# EAGLE schematic untitled (EAGLE 9.6.2)
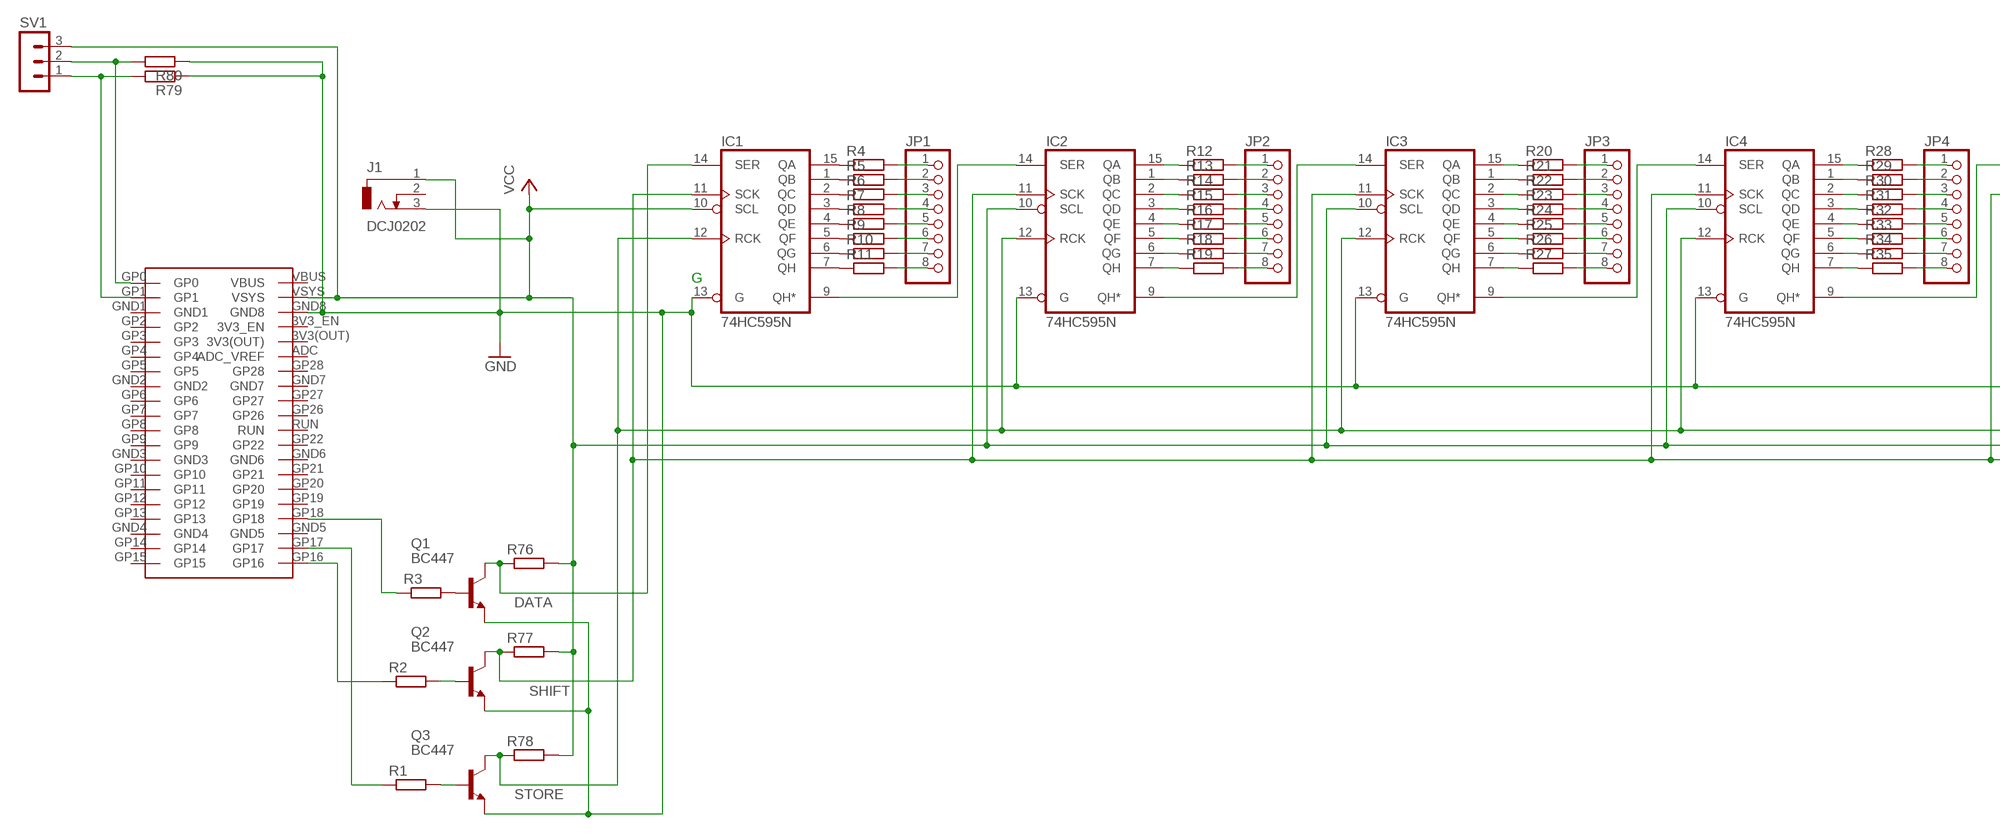
[diagram p0: schematic, sheet 1, part 1 of 2]
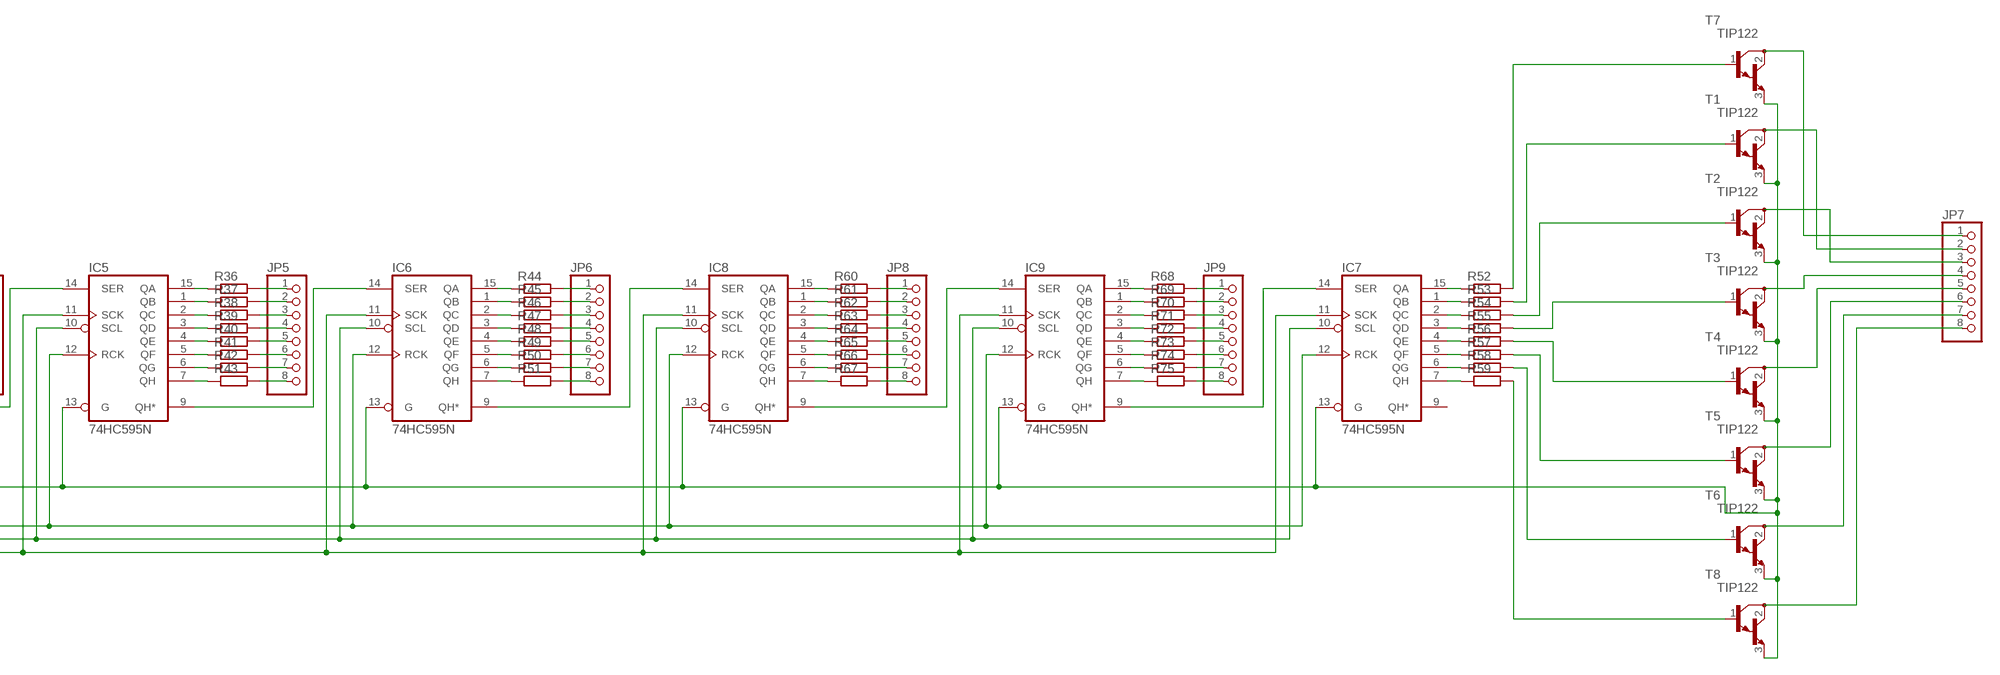
[diagram p1: schematic, sheet 1, part 2 of 2]

## Parts
IC1  74HC595N  [DIL16]
IC2  74HC595N  [DIL16]
IC3  74HC595N  [DIL16]
IC4  74HC595N  [DIL16]
IC5  74HC595N  [DIL16]
IC6  74HC595N  [DIL16]
IC7  74HC595N  [DIL16]
IC8  74HC595N  [DIL16]
IC9  74HC595N  [DIL16]
J1  DCJ0202  [DCJ0202]
JP1  PINHD-1X8  [1X08]
JP2  PINHD-1X8  [1X08]
JP3  PINHD-1X8  [1X08]
JP4  PINHD-1X8  [1X08]
JP5  PINHD-1X8  [1X08]
JP6  PINHD-1X8  [1X08]
JP7  PINHD-1X8  [1X08]
JP8  PINHD-1X8  [1X08]
JP9  PINHD-1X8  [1X08]
Q1  BC447  [TO92-EBC]
Q2  BC447  [TO92-EBC]
Q3  BC447  [TO92-EBC]
R1  R-EU_0207/10  [0207/10]
R2  R-EU_0207/10  [0207/10]
R3  R-EU_0207/10  [0207/10]
R4  R-EU_0207/10  [0207/10]
R5  R-EU_0207/10  [0207/10]
R6  R-EU_0207/10  [0207/10]
R7  R-EU_0207/10  [0207/10]
R8  R-EU_0207/10  [0207/10]
R9  R-EU_0207/10  [0207/10]
R10  R-EU_0207/10  [0207/10]
R11  R-EU_0207/10  [0207/10]
R12  R-EU_0207/10  [0207/10]
R13  R-EU_0207/10  [0207/10]
R14  R-EU_0207/10  [0207/10]
R15  R-EU_0207/10  [0207/10]
R16  R-EU_0207/10  [0207/10]
R17  R-EU_0207/10  [0207/10]
R18  R-EU_0207/10  [0207/10]
R19  R-EU_0207/10  [0207/10]
R20  R-EU_0207/10  [0207/10]
R21  R-EU_0207/10  [0207/10]
R22  R-EU_0207/10  [0207/10]
R23  R-EU_0207/10  [0207/10]
R24  R-EU_0207/10  [0207/10]
R25  R-EU_0207/10  [0207/10]
R26  R-EU_0207/10  [0207/10]
R27  R-EU_0207/10  [0207/10]
R28  R-EU_0207/10  [0207/10]
R29  R-EU_0207/10  [0207/10]
R30  R-EU_0207/10  [0207/10]
R31  R-EU_0207/10  [0207/10]
R32  R-EU_0207/10  [0207/10]
R33  R-EU_0207/10  [0207/10]
R34  R-EU_0207/10  [0207/10]
R35  R-EU_0207/10  [0207/10]
R36  R-EU_0207/10  [0207/10]
R37  R-EU_0207/10  [0207/10]
R38  R-EU_0207/10  [0207/10]
R39  R-EU_0207/10  [0207/10]
R40  R-EU_0207/10  [0207/10]
R41  R-EU_0207/10  [0207/10]
R42  R-EU_0207/10  [0207/10]
R43  R-EU_0207/10  [0207/10]
R44  R-EU_0207/10  [0207/10]
R45  R-EU_0207/10  [0207/10]
R46  R-EU_0207/10  [0207/10]
R47  R-EU_0207/10  [0207/10]
R48  R-EU_0207/10  [0207/10]
R49  R-EU_0207/10  [0207/10]
R50  R-EU_0207/10  [0207/10]
R51  R-EU_0207/10  [0207/10]
R52  R-EU_0207/10  [0207/10]
R53  R-EU_0207/10  [0207/10]
R54  R-EU_0207/10  [0207/10]
R55  R-EU_0207/10  [0207/10]
R56  R-EU_0207/10  [0207/10]
R57  R-EU_0207/10  [0207/10]
R58  R-EU_0207/10  [0207/10]
R59  R-EU_0207/10  [0207/10]
R60  R-EU_0207/10  [0207/10]
R61  R-EU_0207/10  [0207/10]
R62  R-EU_0207/10  [0207/10]
R63  R-EU_0207/10  [0207/10]
R64  R-EU_0207/10  [0207/10]
R65  R-EU_0207/10  [0207/10]
R66  R-EU_0207/10  [0207/10]
R67  R-EU_0207/10  [0207/10]
R68  R-EU_0207/10  [0207/10]
R69  R-EU_0207/10  [0207/10]
R70  R-EU_0207/10  [0207/10]
R71  R-EU_0207/10  [0207/10]
R72  R-EU_0207/10  [0207/10]
R73  R-EU_0207/10  [0207/10]
R74  R-EU_0207/10  [0207/10]
R75  R-EU_0207/10  [0207/10]
R76  R-EU_0207/10  [0207/10]
R77  R-EU_0207/10  [0207/10]
R78  R-EU_0207/10  [0207/10]
R79  R-EU_0207/10  [0207/10]
R80  R-EU_0207/10  [0207/10]
SV1  MA03-1  [MA03-1]
T1  TIP122  [TO220]
T2  TIP122  [TO220]
T3  TIP122  [TO220]
T4  TIP122  [TO220]
T5  TIP122  [TO220]
T6  TIP122  [TO220]
T7  TIP122  [TO220]
T8  TIP122  [TO220]
U$2  PI_PICO  [PI_PICO]

## Nets
DATA: IC1.14(SER) Q1.C R76.1
GND: IC1.13(G) IC2.13(G) IC3.13(G) IC4.13(G) IC5.13(G) IC6.13(G) IC7.13(G) IC8.13(G) IC9.13(G) J1.3 Q1.E Q2.E Q3.E R79.1 R80.1 T1.3(E) T2.3(E) T3.3(E) T4.3(E) T5.3(E) T6.3(E) T7.3(E) T8.3(E) U$2.GND8
N$1: R1.1 U$2.GP17
N$2: Q3.B R1.2
N$4: Q2.B R2.2
N$5: Q1.B R3.2
N$6: R3.1 U$2.GP18
N$7: R2.1 U$2.GP16
N$8: IC1.15(QA) R4.1
N$9: IC1.5(QF) R9.1
N$10: IC1.6(QG) R10.1
N$11: IC1.7(QH) R11.1
N$12: JP1.1 R4.2
N$13: JP1.2 R5.2
N$14: IC1.1(QB) R5.1
N$15: IC1.2(QC) R6.1
N$16: IC1.3(QD) R7.1
N$17: IC1.4(QE) R8.1
N$18: JP1.3 R6.2
N$19: JP1.4 R7.2
N$20: JP1.5 R8.2
N$21: JP1.6 R9.2
N$22: JP1.7 R10.2
N$23: JP1.8 R11.2
N$24: IC2.1(QB) R13.1
N$25: IC2.2(QC) R14.1
N$26: IC2.3(QD) R15.1
N$27: IC2.4(QE) R16.1
N$28: IC1.9(QH*) IC2.14(SER)
N$29: IC2.15(QA) R12.1
N$30: IC2.5(QF) R17.1
N$31: IC2.6(QG) R18.1
N$32: IC2.7(QH) R19.1
N$33: JP2.1 R12.2
N$34: JP2.2 R13.2
N$35: JP2.3 R14.2
N$36: JP2.4 R15.2
N$37: JP2.5 R16.2
N$38: JP2.6 R17.2
N$39: JP2.7 R18.2
N$40: JP2.8 R19.2
N$41: R80.2 SV1.2 U$2.GP0
N$42: IC2.9(QH*) IC3.14(SER)
N$43: R79.2 SV1.1 U$2.GP1
N$44: IC3.1(QB) R21.1
N$45: IC3.2(QC) R22.1
N$46: IC3.3(QD) R23.1
N$47: IC3.4(QE) R24.1
N$48: IC3.15(QA) R20.1
N$49: IC3.5(QF) R25.1
N$50: IC3.6(QG) R26.1
N$51: IC3.7(QH) R27.1
N$52: JP3.1 R20.2
N$53: JP3.2 R21.2
N$54: JP3.3 R22.2
N$55: JP3.4 R23.2
N$56: JP3.5 R24.2
N$57: JP3.6 R25.2
N$58: JP3.7 R26.2
N$59: JP3.8 R27.2
N$60: IC7.15(QA) R52.1
N$61: IC3.9(QH*) IC4.14(SER)
N$62: IC7.1(QB) R53.1
N$63: IC4.1(QB) R29.1
N$64: IC4.2(QC) R30.1
N$65: IC4.3(QD) R31.1
N$66: IC4.4(QE) R32.1
N$67: IC4.15(QA) R28.1
N$68: IC4.5(QF) R33.1
N$69: IC4.6(QG) R34.1
N$70: IC4.7(QH) R35.1
N$71: JP4.1 R28.2
N$72: JP4.2 R29.2
N$73: JP4.3 R30.2
N$74: JP4.4 R31.2
N$75: JP4.5 R32.2
N$76: JP4.6 R33.2
N$77: JP4.7 R34.2
N$78: JP4.8 R35.2
N$79: IC7.2(QC) R54.1
N$80: IC4.9(QH*) IC5.14(SER)
N$81: IC7.3(QD) R55.1
N$82: IC5.1(QB) R37.1
N$83: IC5.2(QC) R38.1
N$84: IC5.3(QD) R39.1
N$85: IC5.4(QE) R40.1
N$86: IC5.15(QA) R36.1
N$87: IC5.5(QF) R41.1
N$88: IC5.6(QG) R42.1
N$89: IC5.7(QH) R43.1
N$90: JP5.1 R36.2
N$91: JP5.2 R37.2
N$92: JP5.3 R38.2
N$93: JP5.4 R39.2
N$94: JP5.5 R40.2
N$95: JP5.6 R41.2
N$96: JP5.7 R42.2
N$97: JP5.8 R43.2
N$98: IC7.4(QE) R56.1
N$99: IC5.9(QH*) IC6.14(SER)
N$100: IC7.5(QF) R57.1
N$101: IC6.1(QB) R45.1
N$102: IC6.2(QC) R46.1
N$103: IC6.3(QD) R47.1
N$104: IC6.4(QE) R48.1
N$105: IC6.15(QA) R44.1
N$106: IC6.5(QF) R49.1
N$107: IC6.6(QG) R50.1
N$108: IC6.7(QH) R51.1
N$109: JP6.1 R44.2
N$110: JP6.2 R45.2
N$111: JP6.3 R46.2
N$112: JP6.4 R47.2
N$113: JP6.5 R48.2
N$114: JP6.6 R49.2
N$115: JP6.7 R50.2
N$116: JP6.8 R51.2
N$117: IC7.6(QG) R58.1
N$119: IC7.7(QH) R59.1
N$120: R52.2 T7.1(B)
N$121: R53.2 T1.1(B)
N$122: R54.2 T2.1(B)
N$123: R55.2 T3.1(B)
N$124: R56.2 T4.1(B)
N$125: R57.2 T5.1(B)
N$126: R58.2 T6.1(B)
N$127: R59.2 T8.1(B)
N$128: JP7.1 T7.2(C)
N$129: JP7.2 T1.2(C)
N$130: JP7.3 T2.2(C)
N$131: JP7.4 T3.2(C)
N$132: JP7.5 T4.2(C)
N$133: JP7.6 T5.2(C)
N$134: JP7.7 T6.2(C)
N$135: JP7.8 T8.2(C)
N$136: IC6.9(QH*) IC8.14(SER)
N$137: IC8.1(QB) R61.1
N$138: IC8.2(QC) R62.1
N$139: IC8.3(QD) R63.1
N$140: IC8.4(QE) R64.1
N$141: IC8.15(QA) R60.1
N$142: IC8.5(QF) R65.1
N$143: IC8.6(QG) R66.1
N$144: IC8.7(QH) R67.1
N$145: JP8.1 R60.2
N$146: JP8.2 R61.2
N$147: JP8.3 R62.2
N$148: JP8.4 R63.2
N$149: JP8.5 R64.2
N$150: JP8.6 R65.2
N$151: JP8.7 R66.2
N$152: JP8.8 R67.2
N$154: IC8.9(QH*) IC9.14(SER)
N$155: IC9.1(QB) R69.1
N$156: IC9.2(QC) R70.1
N$157: IC9.3(QD) R71.1
N$158: IC9.4(QE) R72.1
N$159: IC9.15(QA) R68.1
N$160: IC9.5(QF) R73.1
N$161: IC9.6(QG) R74.1
N$162: IC9.7(QH) R75.1
N$163: JP9.1 R68.2
N$164: JP9.2 R69.2
N$165: JP9.3 R70.2
N$166: JP9.4 R71.2
N$167: JP9.5 R72.2
N$168: JP9.6 R73.2
N$169: JP9.7 R74.2
N$170: JP9.8 R75.2
N$173: IC7.14(SER) IC9.9(QH*)
SHIFT: IC1.11(SCK) IC2.11(SCK) IC3.11(SCK) IC4.11(SCK) IC5.11(SCK) IC6.11(SCK) IC7.11(SCK) IC8.11(SCK) IC9.11(SCK) Q2.C R77.1
STORE: IC1.12(RCK) IC2.12(RCK) IC3.12(RCK) IC4.12(RCK) IC5.12(RCK) IC6.12(RCK) IC7.12(RCK) IC8.12(RCK) IC9.12(RCK) Q3.C R78.1
VCC: IC1.10(SCL) IC2.10(SCL) IC3.10(SCL) IC4.10(SCL) IC5.10(SCL) IC6.10(SCL) IC7.10(SCL) IC8.10(SCL) IC9.10(SCL) J1.1 R76.2 R77.2 R78.2 SV1.3 U$2.VSYS
Unconnected: IC7.9(QH*) J1.2 U$2.3V3(OUT) U$2.3V3_EN U$2.ADC(ADC_VREF) U$2.GND1 U$2.GND2 U$2.GND3 U$2.GND4 U$2.GND5 U$2.GND6 U$2.GND7 U$2.GP2 U$2.GP3 U$2.GP4 U$2.GP5 U$2.GP6 U$2.GP7 U$2.GP8 U$2.GP9 U$2.GP10 U$2.GP11 U$2.GP12 U$2.GP13 U$2.GP14 U$2.GP15 U$2.GP19 U$2.GP20 U$2.GP21 U$2.GP22 U$2.GP26 U$2.GP27 U$2.GP28 U$2.RUN U$2.VBUS

## Notes on the sheet
- G

## Power pins joined to a net without a drawn wire
GND: IC1.8(GND) IC2.8(GND) IC3.8(GND) IC4.8(GND) IC5.8(GND) IC6.8(GND) IC7.8(GND) IC8.8(GND) IC9.8(GND)
VCC: IC1.16(VCC) IC2.16(VCC) IC3.16(VCC) IC4.16(VCC) IC5.16(VCC) IC6.16(VCC) IC7.16(VCC) IC8.16(VCC) IC9.16(VCC)

## Library data of the parts
IC1-IC9 = 74xx-eu:74*595: 8-bit SHIFT REGISTER, output latch
J1 = con-jack:DCJ0202: DC POWER JACK Source: DCJ0202.pdf; OC_FARNELL: unknown; OC_NEWARK: unknown
JP1-JP9 = pinhead:PINHD-1X8: PIN HEADER
Q1-Q3 = transistor-npn:BC447*: NPN Transistor
R1-R80 = rcl:R-EU_: RESISTOR, European symbol; SPICEPREFIX: R
SV1 = con-lstb:MA03-1: PIN HEADER; OC_FARNELL: unknown; OC_NEWARK: unknown
T1-T8 = transistor:TIP122: NPN BIPOLAR DARLINGTON TRANSISTOR
U$2 = PI_PICO:PI_PICO